# Altium schematic sheet AUAV_X05_FMUESP.SchDoc
size A3
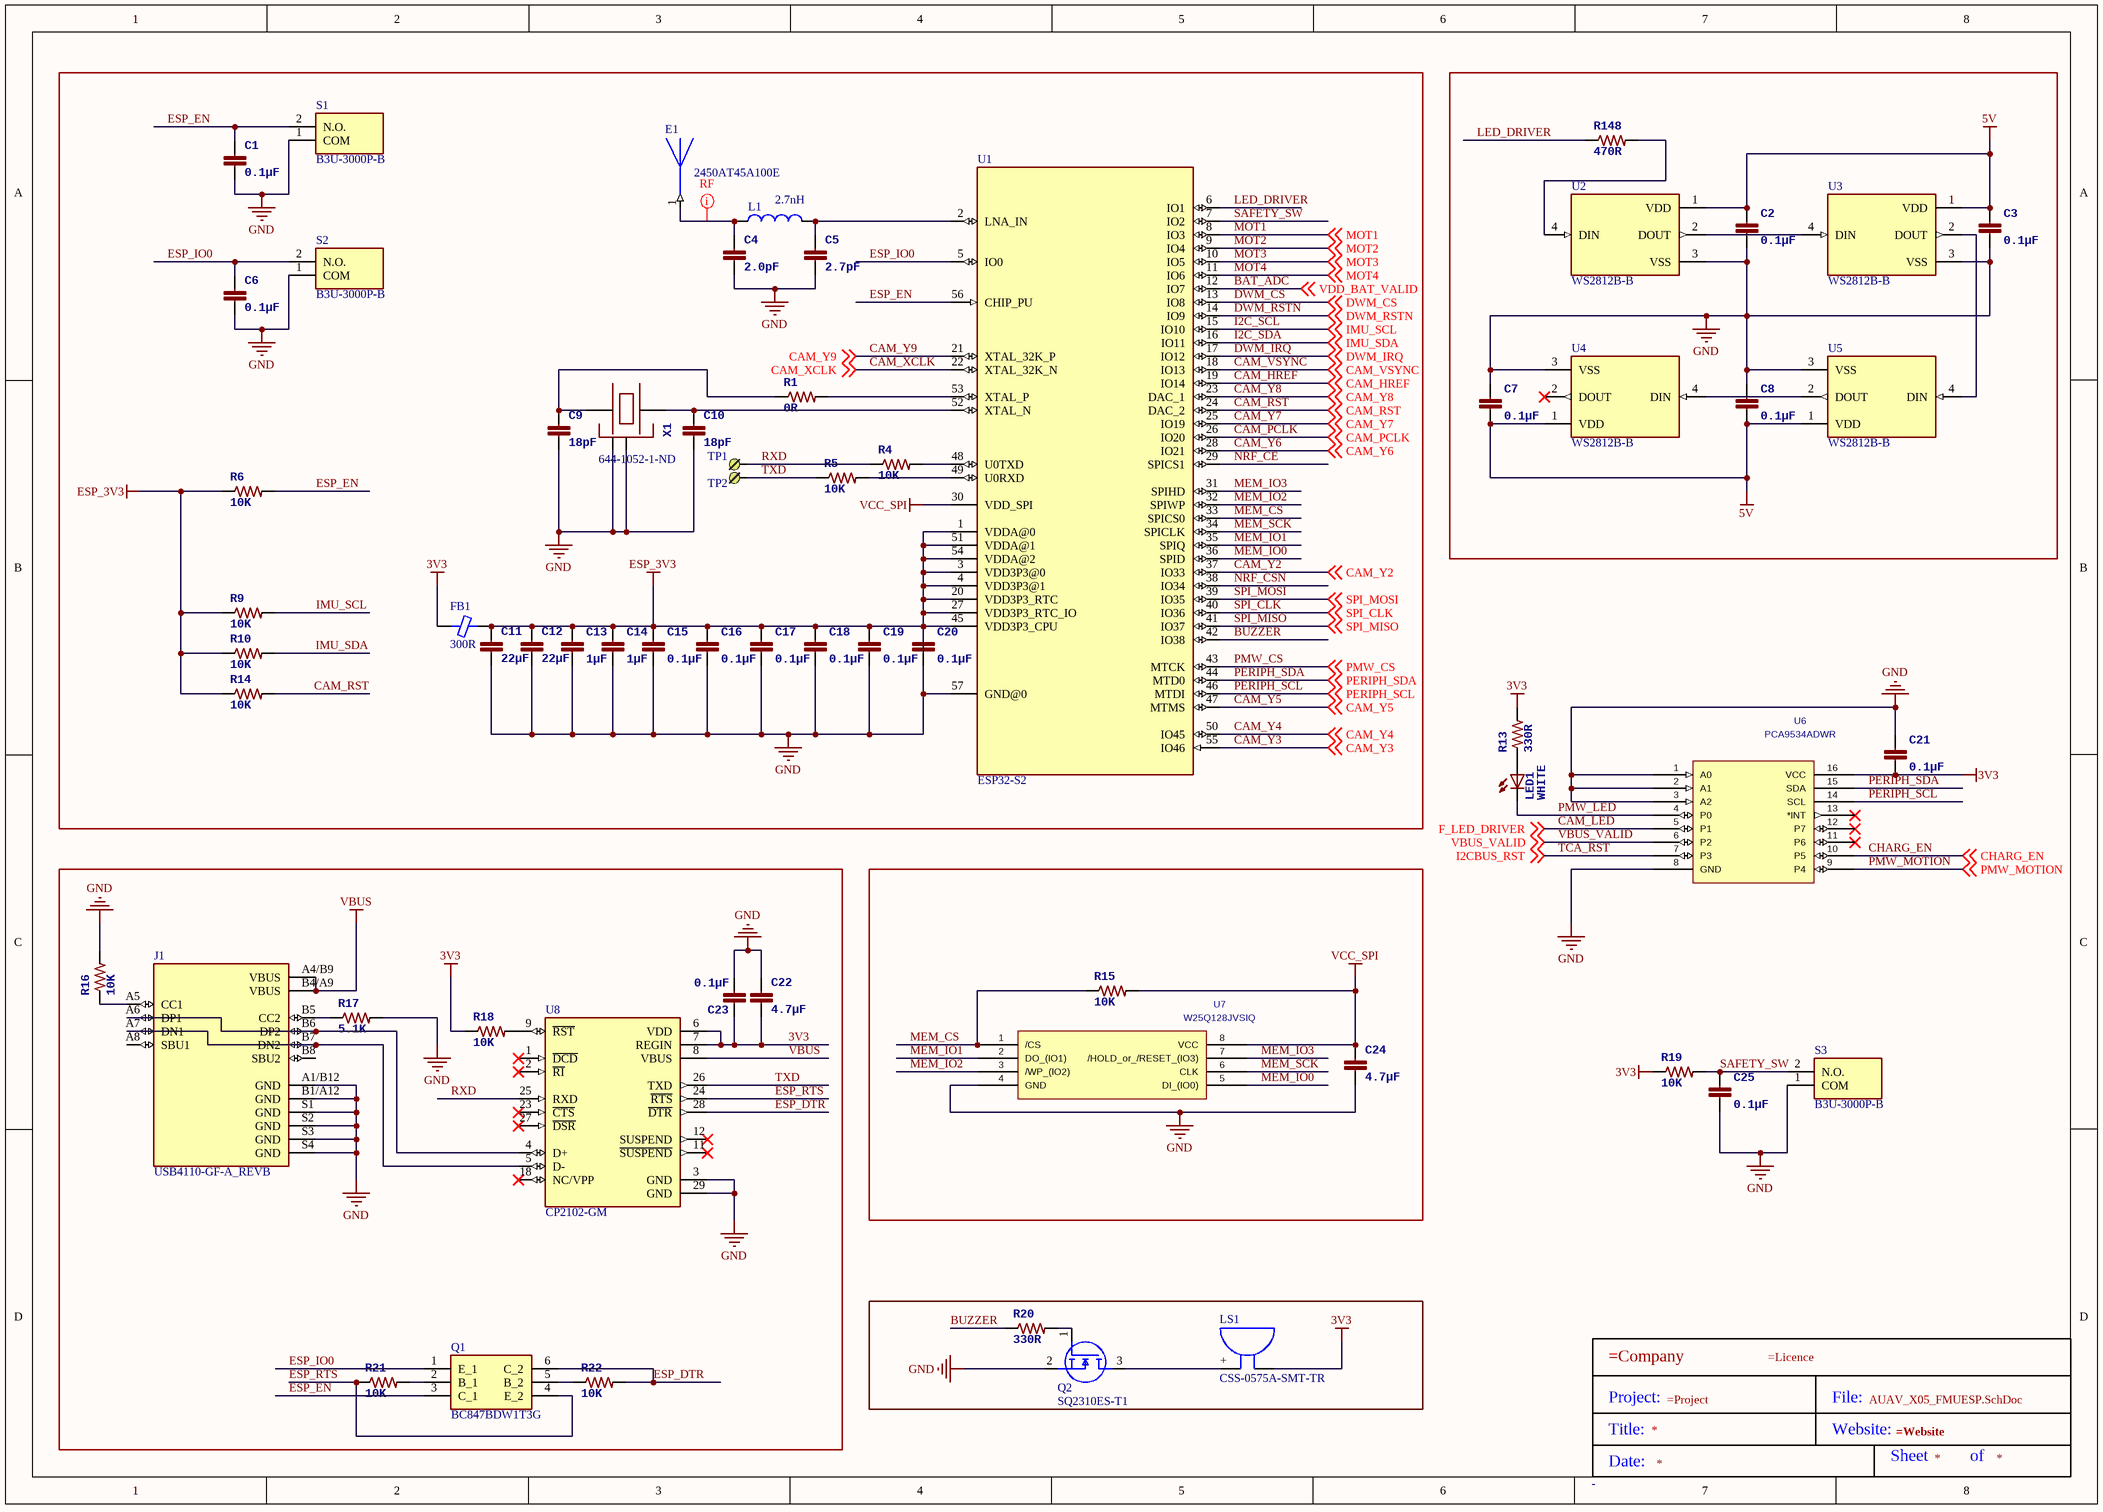
[diagram p0: AUAV_X05_FMUESP.SchDoc]

## Parts
*?  Title Block  (value not drawn)
C1  0.1µF  [0402-CAP]
C2  0.1µF  [0402-CAP]
C3  0.1µF  [0402-CAP]
C4  2.0pF  [0402-CAP]
C5  2.7pF  [0402-CAP]
C6  0.1µF  [0402-CAP]
C7  0.1µF  [0402-CAP]
C8  0.1µF  [0402-CAP]
C9  18pF  [0402-CAP]
C10  18pF  [0402-CAP]
C11  22µF  [0805-CAP]
C12  22µF  [0805-CAP]
C13  1µF  [0402-CAP]
C14  1µF  [0402-CAP]
C15  0.1µF  [0402-CAP]
C16  0.1µF  [0402-CAP]
C17  0.1µF  [0402-CAP]
C18  0.1µF  [0402-CAP]
C19  0.1µF  [0402-CAP]
C20  0.1µF  [0402-CAP]
C21  0.1µF  [0402-CAP]
C22  4.7µF  [0603-CAP]
C23  0.1µF  [0402-CAP]
C24  4.7µF  [0603-CAP]
C25  0.1µF  [0402-CAP]
E1  2450AT45A100E  [ANT_2450AT45A100E]
FB1  300R  [FER 0402_1005]
J1  USB4110-GF-A_REVB  [GCT_USB4110-GF-A_REVB]
L1  2.7nH  [INDC1005X65N]
LED1  WHITE  [0603-LED]
LS1  CSS-0575A-SMT-TR  [CUI CSS-0575A-SMT-TR]
Q1  BC847BDW1T3G  [SOT65P210X110-6N]
Q2  SQ2310ES-T1  [SOT95P237X112-3N]
R1  0R  [0402-RES]
R4  10K  [0402-RES]
R5  10K  [0402-RES]
R6  10K  [0402-RES]
R9  10K  [0402-RES]
R10  10K  [0402-RES]
R13  330R  [0402-RES]
R14  10K  [0402-RES]
R15  10K  [0402-RES]
R16  10K  [0402-RES]
R17  5.1K  [0402-RES]
R18  10K  [0402-RES]
R19  10K  [0402-RES]
R20  330R  [0402-RES]
R21  10K  [0402-RES]
R22  10K  [0402-RES]
R148  470R  [0402-RES]
S1  B3U-3000P-B  [B3U3000PB]
S2  B3U-3000P-B  [B3U3000PB]
S3  B3U-3000P-B  [B3U3000PB]
TP1  TP  [SMT_PAD]  (value not drawn)
TP2  TP  [SMT_PAD]  (value not drawn)
U1  ESP32-S2  [QFN40P700X700X90-57T400N]
U2  WS2812B-B  [LED_WS2812B-B]
U3  WS2812B-B  [LED_WS2812B-B]
U4  WS2812B-B  [LED_WS2812B-B]
U5  WS2812B-B  [LED_WS2812B-B]
U6  PCA9534ADWR  [DW16]
U7  W25Q128JVSIQ  [SOIC_128JVSIQ_WI]
U8  CP2102-GM  [QFN50P500X500X100-29N]
X1  Supplier Part Number 1: 644-1052-1-ND  [OSCILLATOR-3.2X2.5]  (hidden comment: Crystal Oscillator in 3.2x2.5 SMD)

## Nets
3V3: C21.P$2 C22.P$2 C23.P$1 FB1.1 LS1.- R13.P$2 R18.P$1 R19.P$1 U6.16(VCC) U8.6(VDD) U8.7(REGIN)
5V: C2.P$1 C3.P$1 C7.P$2 C8.P$2 U2.1(VDD) U3.1(VDD) U4.1(VDD) U5.1(VDD)
ESP_3V3: C11.P$1 C12.P$1 C13.P$1 C14.P$1 C15.P$1 C16.P$1 C17.P$1 C18.P$1 C19.P$1 C20.P$1 FB1.2 R6.P$1 R9.P$1 R10.P$1 R14.P$1 U1.1(VDDA@0) U1.3(VDD3P3@0) U1.4(VDD3P3@1) U1.20(VDD3P3_RTC) U1.27(VDD3P3_RTC_IO) U1.45(VDD3P3_CPU) U1.51(VDDA@1) U1.54(VDDA@2)
GND: C1.P$2 C2.P$2 C3.P$2 C4.P$2 C5.P$2 C6.P$2 C7.P$1 C8.P$1 C9.P$2 C10.P$2 C11.P$2 C12.P$2 C13.P$2 C14.P$2 C15.P$2 C16.P$2 C17.P$2 C18.P$2 C19.P$2 C20.P$2 C21.P$1 C22.P$1 C23.P$2 C24.P$2 C25.P$2 J1.A1/B12(GND) J1.B1/A12(GND) J1.S1(GND) J1.S2(GND) J1.S3(GND) J1.S4(GND) Q2.2(S) R16.P$2 R17.P$2 S1.1(COM) S2.1(COM) S3.1(COM) U1.57(GND@0) U2.3(VSS) U3.3(VSS) U4.3(VSS) U5.3(VSS) U6.1(A0) U6.2(A1) U6.3(A2) U6.8(GND) U7.4(GND) U8.3(GND) U8.29(GND) X1.2(NC_2) X1.4(NC_4)
VBUS: J1.A4/B9(VBUS) J1.B4/A9(VBUS) U8.8(VBUS)
VCC_SPI: C24.P$1 R15.P$2 U1.30(VDD_SPI) U7.8(VCC)
BAT_ADC: U1.12(IO7) ; off-sheet VDD_BAT_VALID  [also labelled VDD_BAT_VALID]
BUZZER: R20.P$1 U1.42(IO38)
CAM_HREF: U1.19(IO14) ; off-sheet CAM_HREF
CAM_LED: U6.5(P1) ; off-sheet F_LED_DRIVER  [also labelled F_LED_DRIVER]
CAM_PCLK: U1.26(IO20) ; off-sheet CAM_PCLK
CAM_RST: R14.P$2 U1.24(DAC_2) ; off-sheet CAM_RST
CAM_VSYNC: U1.18(IO13) ; off-sheet CAM_VSYNC
CAM_XCLK: U1.22(XTAL_32K_N) ; off-sheet CAM_XCLK
CAM_Y2: U1.37(IO33) ; off-sheet CAM_Y2
CAM_Y3: U1.55(IO46) ; off-sheet CAM_Y3
CAM_Y4: U1.50(IO45) ; off-sheet CAM_Y4
CAM_Y5: U1.47(MTMS) ; off-sheet CAM_Y5
CAM_Y6: U1.28(IO21) ; off-sheet CAM_Y6
CAM_Y7: U1.25(IO19) ; off-sheet CAM_Y7
CAM_Y8: U1.23(DAC_1) ; off-sheet CAM_Y8
CAM_Y9: U1.21(XTAL_32K_P) ; off-sheet CAM_Y9
CHARG_EN: U6.10(P5) ; off-sheet CHARG_EN
DWM_CS: U1.13(IO8) ; off-sheet DWM_CS
DWM_IRQ: U1.17(IO12) ; off-sheet DWM_IRQ
DWM_RSTN: U1.14(IO9) ; off-sheet DWM_RSTN
ESP_DTR: Q1.6(C_2) R22.P$2 U8.28(~{DTR})
ESP_EN: C1.P$1 Q1.3(C_1) R6.P$2 S1.2(N.O.) U1.56(CHIP_PU)
ESP_IO0: C6.P$1 Q1.1(E_1) S2.2(N.O.) U1.5(IO0)
ESP_RTS: Q1.4(E_2) R21.P$1 U8.24(~{RTS})
I2C_SCL: R9.P$2 U1.15(IO10) ; off-sheet IMU_SCL  [also labelled IMU_SCL]
I2C_SDA: R10.P$2 U1.16(IO11) ; off-sheet IMU_SDA  [also labelled IMU_SDA]
LED_DRIVER: R148.P$1 U1.6(IO1)
MEM_CS: R15.P$1 U1.33(SPICS0) U7.1(/CS)
MEM_IO0: U1.36(SPID) U7.5(DI_(IO0))
MEM_IO1: U1.35(SPIQ) U7.2(DO_(IO1))
MEM_IO2: U1.32(SPIWP) U7.3(/WP_(IO2))
MEM_IO3: U1.31(SPIHD) U7.7(/HOLD_or_/RESET_(IO3))
MEM_SCK: U1.34(SPICLK) U7.6(CLK)
MOT1: U1.8(IO3) ; off-sheet MOT1
MOT2: U1.9(IO4) ; off-sheet MOT2
MOT3: U1.10(IO5) ; off-sheet MOT3
MOT4: U1.11(IO6) ; off-sheet MOT4
NRF_CE: U1.29(SPICS1)
NRF_CSN: U1.38(IO34)
PERIPH_SCL: U1.46(MTDI) U6.14(SCL) ; off-sheet PERIPH_SCL
PERIPH_SDA: U1.44(MTD0) U6.15(SDA) ; off-sheet PERIPH_SDA
PMW_CS: U1.43(MTCK) ; off-sheet PMW_CS
PMW_LED: LED1.C U6.4(P0)
PMW_MOTION: U6.9(P4) ; off-sheet PMW_MOTION
RXD: R4.P$1 TP1.1 U8.25(RXD)
SAFETY_SW: C25.P$1 R19.P$2 S3.2(N.O.) U1.7(IO2)
SPI_CLK: U1.40(IO36) ; off-sheet SPI_CLK
SPI_MISO: U1.41(IO37) ; off-sheet SPI_MISO
SPI_MOSI: U1.39(IO35) ; off-sheet SPI_MOSI
TCA_RST: U6.7(P3) ; off-sheet I2CBUS_RST  [also labelled I2CBUS_RST]
TXD: R5.P$1 TP2.1 U8.26(TXD)
VBUS_VALID: U6.6(P2) ; off-sheet VBUS_VALID
NetC4_P$1: C4.P$1 E1.1 L1.1
NetC5_P$1: C5.P$1 L1.2 U1.2(LNA_IN)
NetC9_P$1: C9.P$1 R1.P$1 X1.1
NetC10_P$1: C10.P$1 U1.52(XTAL_N) X1.3
NetJ1_A5: J1.A5(CC1) R16.P$1
NetJ1_A6: J1.A6(DP1) J1.B6(DP2) U8.4(D+)
NetJ1_A7: J1.A7(DN1) J1.B7(DN2) U8.5(D-)
NetJ1_B5: J1.B5(CC2) R17.P$1
NetLED1_A: LED1.A R13.P$1
NetLS1_+: LS1.+ Q2.3(D)
NetQ1_2: Q1.2(B_1) R21.P$2
NetQ1_5: Q1.5(B_2) R22.P$1
NetQ2_1: Q2.1(G) R20.P$2
NetR1_P$2: R1.P$2 U1.53(XTAL_P)
NetR4_P$2: R4.P$2 U1.48(U0TXD)
NetR5_P$2: R5.P$2 U1.49(U0RXD)
NetR18_P$2: R18.P$2 U8.9(~{RST})
NetR148_P$2: R148.P$2 U2.4(DIN)
NetU2_2: U2.2(DOUT) U3.4(DIN)
NetU3_2: U3.2(DOUT) U5.4(DIN)
NetU4_4: U4.4(DIN) U5.2(DOUT)

Not connected (* = marked no-connect by the designer): J1 A8(SBU1) B8(SBU2); U4 2(DOUT)*; U6 11(P6)* 12(P7)* 13(*INT)*; U8 1(~{DCD})* 2(~{RI})* 11(~{SUSPEND})* 12(SUSPEND)* 18(NC/VPP)* 23(~{CTS})* 27(~{DSR})*

## Layout directives
net class RF: NetC4_P$1

## Notes on the sheet
- (in symbol Title Block) Project:; File:; Title:; Website:; Sheet; of; Date:

## Library data of the parts
C1-C10 C13-C21 C23 C25 = CAP0402: CAP CER 8PF 50V C0G 0402; PARTNO: C1005C0G1H080C; 3DR_PARTNO: ECM0710; Value: 8p; Supplier 1: Digi-Key; Supplier Part Number 1: 445-4890-1-ND
C11 C12 = CAP0805: CAP CER 4.7UF 16V 10% X7R 0805; PARTNO: CL21B475KOFNNNE; 3DR_PARTNO: ECM0622; Value: 4u7; DATASHEET: http://www.digikey.com/product-detail/en/CL21B475KOFNNNE/1276-2873-2-ND/3888531; Supplier 1: Digi-Key; Supplier Part Number 1: 1276-2873-1-ND
C22 C24 = CAP0603: CAP CER 2.2UF 16V 10% X6S 0603; PARTNO: C1608X6S1C225K080AC; 3DR_PARTNO: ECM0619; Value: 2u2; Supplier 1: Digi-Key; Supplier Part Number 1: 445-7438-1-ND
E1 = 2450AT45A100E: 2.4GHz Chip RF Antenna 2.4GHz ~ 2.5GHz 2.2dBi Solder Surface Mount; MF: Johanson Technology; Price: None; MP: 2450AT45A100E; Value: *; Package: FBGA-1152 Johanson Technology; SnapEDA_Link: https://www.snapeda.com/parts/2450AT45A100E/Johanson%20Technology%20Inc./view-part/105265/?ref=snap; Availability: Unavailable
FB1 = BLM15EX331SN1D: 0402 (1005) 330OHM 25% 1100MA; Manufacturer: Murata Electronics; Current Rating (Max): 1.1A; Filter Type: Signal Line; Number of Lines: 1; Part Number: BLM15EX331SN1D; ComponentLink1Description: Datasheet; ComponentLink1URL: https://www.murata.com/en-us/products/productdata/8796750970910/ENFA0023.pdf; ComponentLink2Description: DigiKey Link; ComponentLink2URL: http://digikey.com/product-detail/en/murata-electronics/BLM15EX331SN1D/490-18371-1-ND/9955444; Device Package: 0402 (1005 Metric); Height (Max): 0.022" (0.55mm); LastUpdated: 02-09-2020 01:18:11; Lifecycle Status: Active; Minimum Order: 1; Mounting Type: Surface Mount; Operating Temperature: -55°C ~ 125°C; Package / Case: 0402 (1005 Metric); Packaging: TapeAndReel; PartId: 364; Part Status: Active; Price: 0.06; Series: *; Size / Dimension: 0.039" L x 0.022" W (1.00mm x 0.55mm); Supplier 1: DigiKey; Supplier Part Number 1: 490-18371-1-ND
J1 = USB4110-GF-A_REVB: USB-C (USB TYPE-C) USB 2.0 Receptacle Connector 24 (16+8 Dummy) Position Surface Mount, Right Angle; Through Hole; MF: GCT; Value: *; Price: None; Package: None; SnapEDA_Link: https://www.snapeda.com/parts/USB4110-GF-A/Global%20Connector%20Technology/view-part/4001167/?ref=snap; Availability: Warning; MP: USB4110-GF-A; Purchase-URL: https://pricing.snapeda.com/search/part/USB4110-GF-A/?ref=eda; Check_prices: https://www.snapeda.com/parts/USB4110-GF-A/Global%20Connector%20Technology/view-part/4001167/?ref=eda
L1 = IND0402: 39nH Unshielded Multilayer Inductor 200mA 1.3Ohm Max 0402 (1005 Metric); MP: AIMC-0402-39NJ-T; MF: Abracon LLC; Package: 0402-2 Abracon; Availability: In Stock; Value: *; SnapEDA_Link: https://www.snapeda.com/parts/AIMC-0402-39NJ-T/Abracon%20LLC/view-part/1612276/?ref=snap; Price: None; Purchase-URL: https://pricing.snapeda.com/search/part/AIMC-0402-39NJ-T/?ref=eda; Check_prices: https://www.snapeda.com/parts/AIMC-0402-39NJ-T/Abracon%20LLC/view-part/1612276/?ref=eda
LED1 = LED0603: LED 1.6X0.8 DOME ORN CLEAR SMD; PARTNO: APTD1608SECK; 3DR_PARTNO: ECM0515; Value: AMBER; Supplier 1: Digi-Key; Supplier Part Number 1: 754-1802-1-ND
LS1 = CSS-0575A-SMT-TR: AUDIO MAGNETIC XDCR 2-4V SMD; Manufacturer: CUI Devices; Current - Supply: 95mA; Driver Circuitry: Transducer, Externally Driven; Frequency: 4kHz; Input Type: Zero-Peak Signal; Operating Mode: Single Tone; Port Location: Top; Sound Pressure Level (SPL): 76dB @ 3V, 10cm; Voltage Range: 2 ~ 4V; Voltage - Rated: 3V; Part Number: CSS-0575A-SMT-TR; ComponentLink1Description: Datasheet; ComponentLink1URL: https://www.cuidevices.com/product/resource/digikeypdf/css-0575a-smt-tr.pdf; ComponentLink2Description: DigiKey Link; ComponentLink2URL: http://digikey.com/product-detail/en/cui-devices/CSS-0575A-SMT-TR/102-2201-1-ND/2364650; Height - Seated (Max): 0.094" (2.40mm); LastUpdated: 24-04-2020 00:39:31; Lifecycle Status: Active; Minimum Order: 1; Mounting Type: Surface Mount; Operating Temperature: -30°C ~ 70°C; Packaging: TapeAndReel; Part Status: Active; Price: 1.50; Series: CSS; Size / Dimension: 0.197" L x 0.197" W (5.00mm x 5.00mm); Supplier 1: DigiKey; Supplier Part Number 1: 102-2201-1-ND; Technology: Magnetic; Termination: Solder Pads
Q1 = BC847BDW1T3G: Transistor BJT NPN; Manufacturer_Name: ON Semiconductor; Datasheet Link: http://www.onsemi.com/pub/Collateral/BC846BDW1T1-D.PDF; Height: 1.1mm; Manufacturer_Part_Number: BC847BDW1T3G; Mouser Part Number: 863-BC847BDW1T3G; Mouser Price/Stock: https://www.mouser.co.uk/ProductDetail/ON-Semiconductor/BC847BDW1T3G?qs=vNc2DXHODiIkZomKfHKn%252Bg%3D%3D; Arrow Part Number: BC847BDW1T3G; Arrow Price/Stock: https://www.arrow.com/en/products/bc847bdw1t3g/on-semiconductor?region=nac
Q2 = SQ2310ES-T1: MOSFET (N-Channel); Manufacturer_Name: Vishay; Datasheet Link: https://www.vishay.com/doc?67036; Height: 1.12mm; Manufacturer_Part_Number: SQ2310ES-T1
R1 R4-R6 R9 R10 R13-R22 R148 = RESISTOR0402-RES: RES 10K OHM 1/16W 1% 0402 SMD; PARTNO: RC0402FR-0710KL; 3DR_PARTNO: ECM0800; Supplier 1: Digi-Key; Value: 10K; Supplier Part Number 1: 311-10.0KLRCT-ND
S1-S3 = B3U-3000P-B: Switch; Manufacturer_Name: Omron Electronics; Datasheet Link: https://componentsearchengine.com/Datasheets/2/B3U-3000P-B.pdf; Height: 1.35mm; Manufacturer_Part_Number: B3U-3000P-B; Mouser Part Number: 653-B3U-3000P-B; Mouser Price/Stock: https://www.mouser.co.uk/ProductDetail/Omron-Electronics/B3U-3000P-B?qs=AO7BQMcsEu4JAdtnbsGArA%3D%3D; Arrow Part Number: B3U-3000P-B; Arrow Price/Stock: https://www.arrow.com/en/products/b3u-3000p-b/omron?region=nac
U1 = ESP32-S2: SMD WI-FI IC, ESP32-S2, SINGAL-C; MF: Espressif Systems; Value: *; Package: None; Price: None; MP: ESP32-S2; Availability: Unavailable; SnapEDA_Link: https://www.snapeda.com/parts/ESP32-S2/Espressif%20Systems/view-part/4571535/?ref=snap
U2-U5 = WS2812B-B: Intelligent control LED integrated light source; MF: Worldsemi; SnapEDA_Link: https://www.snapeda.com/parts/WS2812B-B/Worldsemi/view-part/5799638/?ref=snap; Package: Package; Check_prices: https://www.snapeda.com/parts/WS2812B-B/Worldsemi/view-part/5799638/?ref=eda; Availability: Unavailable; Price: None; MP: WS2812B-B; Value: *
U6 = PCA9534ADWR: Mfr_Name: Texas Instruments; Value: PCA9534ADWR; Copyright: Copyright (C) 2022 Ultra Librarian. All rights reserved.; Manufacturer_Part_Number: PCA9534ADWR; Digi-Key_Part_Number_1: 296-21759-1-ND; Digi-Key_Part_Number_2: 296-21759-2-ND; Digi-Key_Part_Number_3: 296-21759-6-ND; Digi-Key_Part_Number_4: 2156-PCA9534ADWR-ND
U7 = W25Q128JVSIQ: Mfr_Name: Winbond; C: Copyright (C) 2021 Accelerated Designs. All rights reserved; Value: W25Q128JVSIQ; Copyright: Copyright (C) 2022 Ultra Librarian. All rights reserved.; Manufacturer_Part_Number: W25Q128JVSIQ; Digi-Key_Part_Number_1: W25Q128JVSIQ-ND
U8 = CP2102-GM: USB Bridge, USB to UART USB 2.0 UART Interface 28-QFN _5x5_; MF: Silicon Labs; Package: QFN-28 Silicon Labs; Value: *; Price: None; MP: CP2102-GM; Availability: Unavailable; SnapEDA_Link: https://www.snapeda.com/parts/CP2102-GM/Silicon%20Labs/view-part/135876/?ref=snap
X1 = OSCILLATOR-3.2X2.5: CRYSTAL 24MHZ 8PF SMD; 3DR_PARTNO: ECM0708; PARTNO: NX3225SA-24.000MHZ-STD-CSR-1; Supplier 1: Digi-Key; Value: 24MHz
*? = Title Block: Size: -